# EasyEDA Pro project Wheelbase Breakout Board.epro

# Schematic Schematic1
Board Name: Board1; Create Date: 2024-10-20
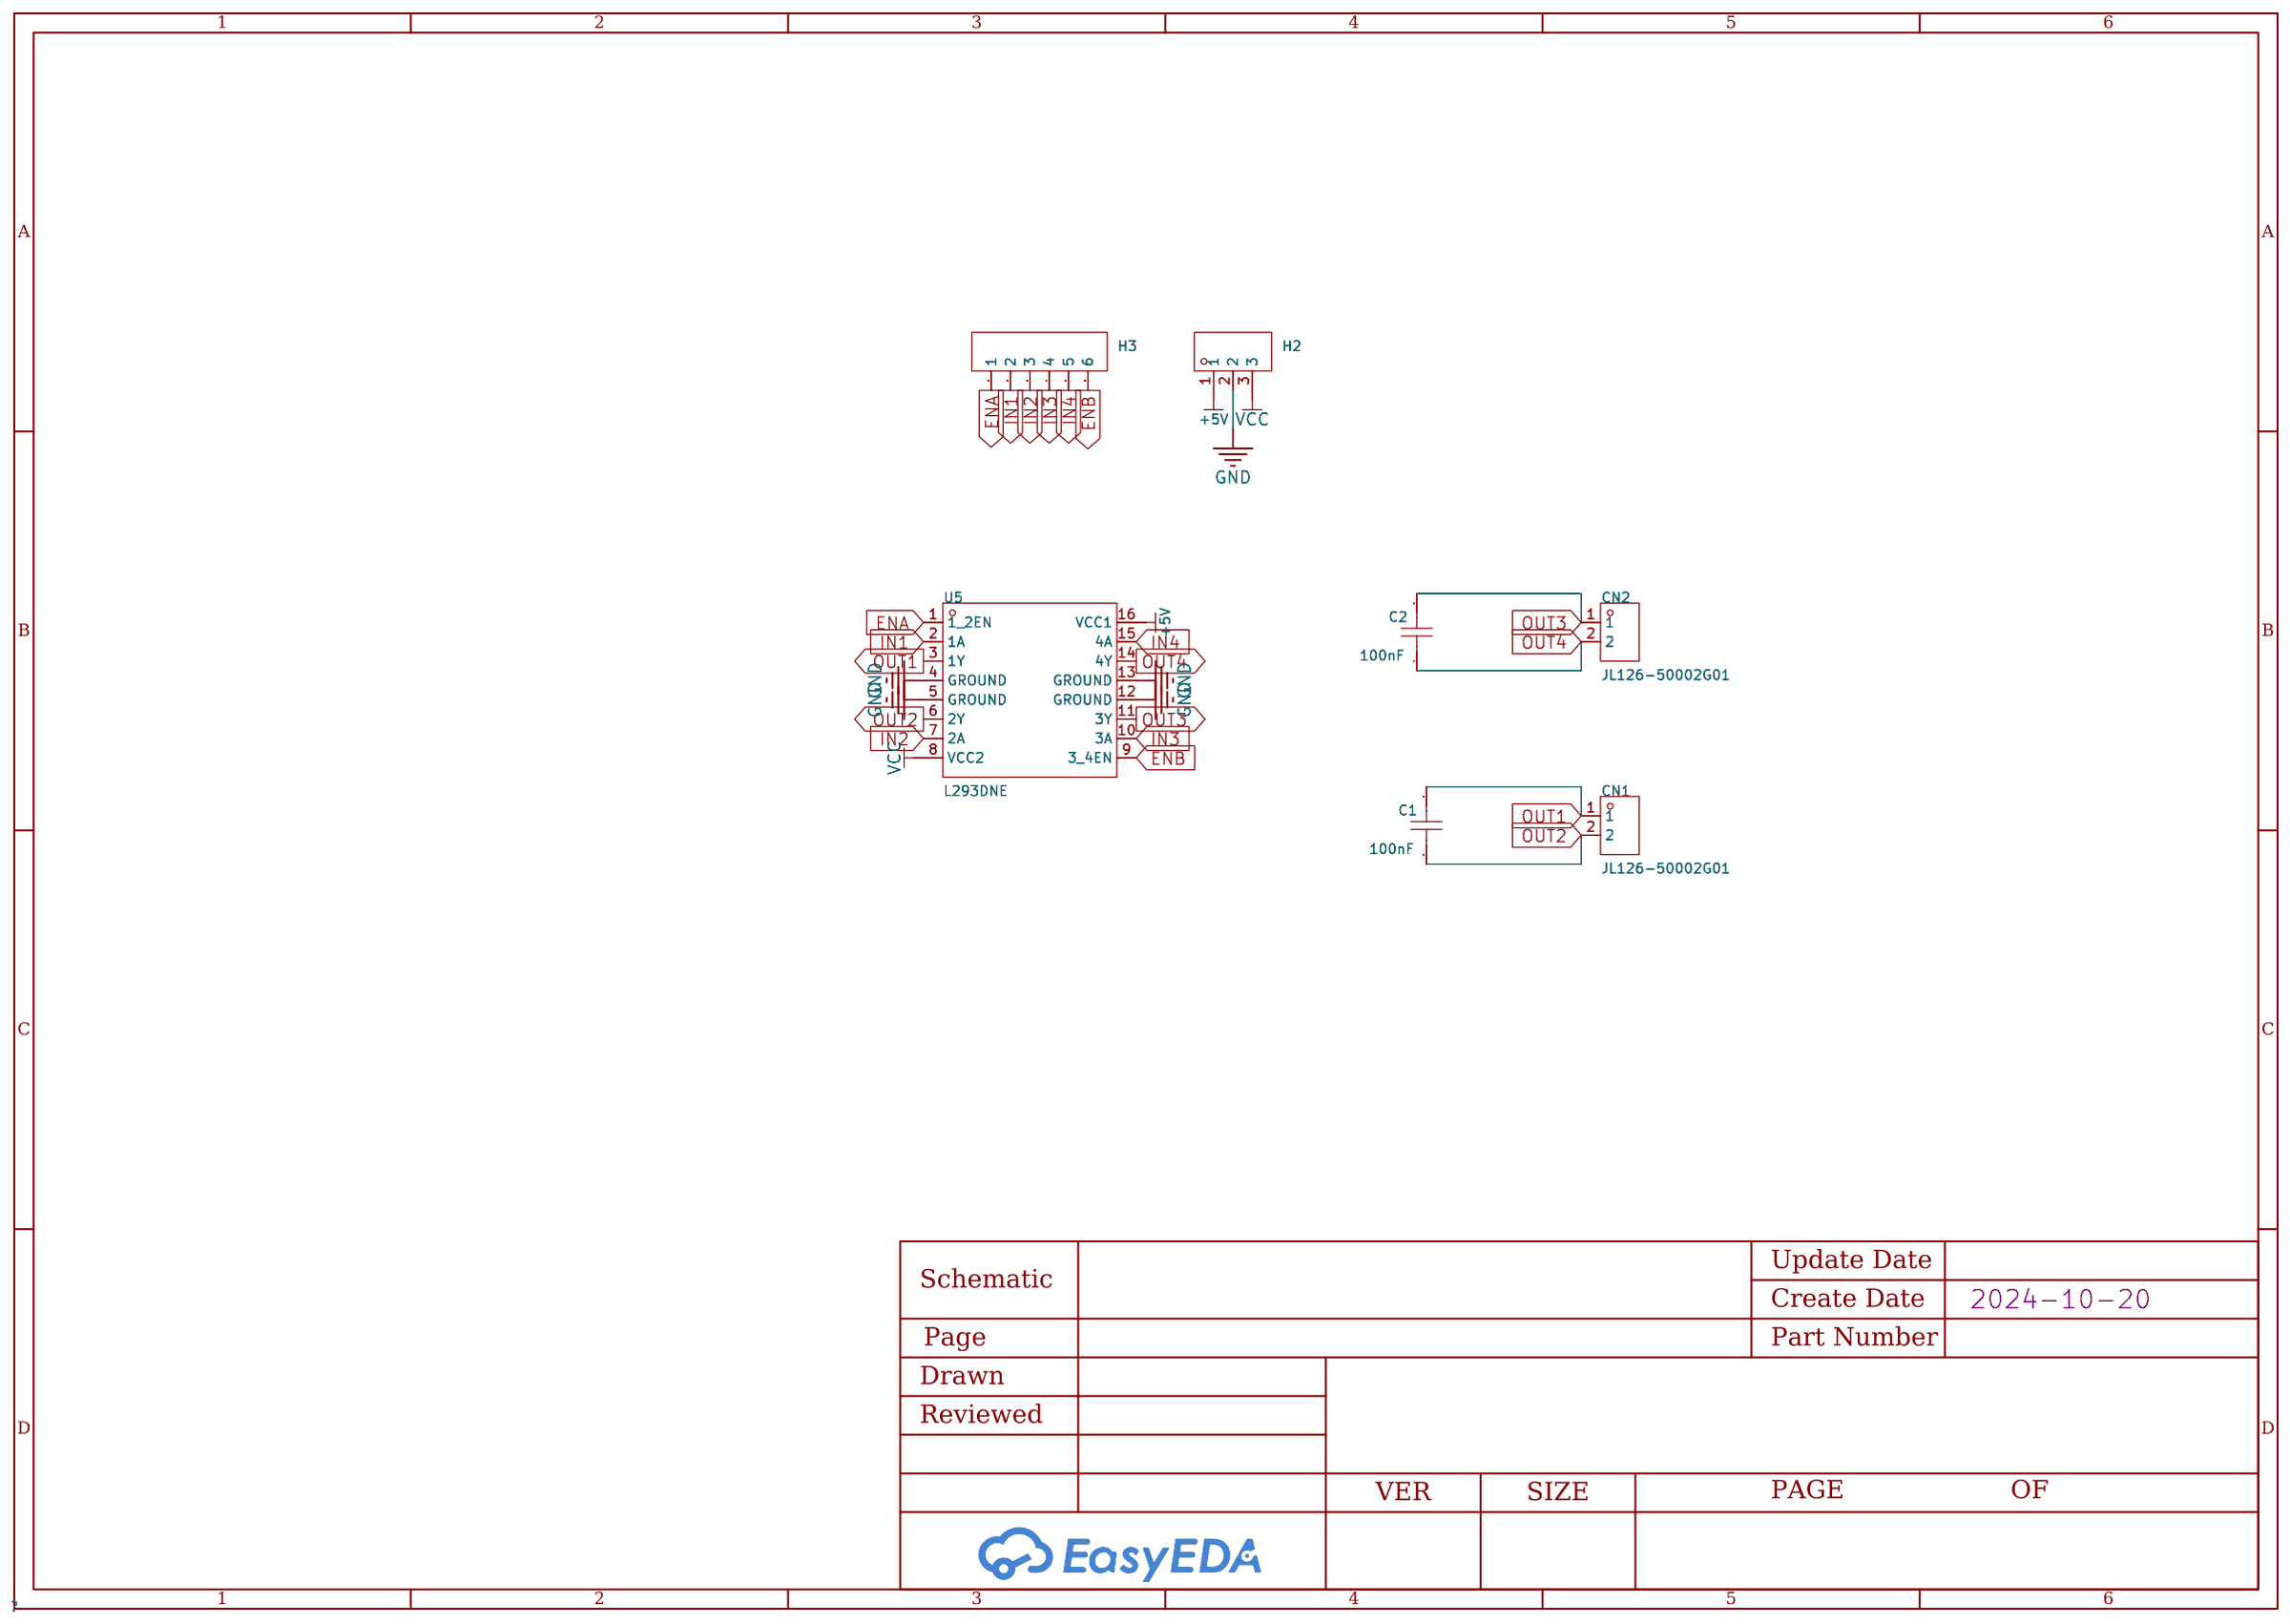
[diagram p0: schematic sheet]

## Parts
C1  100nF  [CAP-TH_L6.5-W2.5-P7.50-D0.5]
C2  100nF  [CAP-TH_L6.5-W2.5-P7.50-D0.5]
CN1  JL126-50002G01  [CONN-TH_2P-P5.00_JL126-50002G01]
CN2  JL126-50002G01  [CONN-TH_2P-P5.00_JL126-50002G01]
H2  -  [HDR-TH_3P-P2.54-V-M]
H3  -  [HDR-TH_6P-P2.54-V-M-1]
U5  L293DNE  [DIP-16_L20.0-W6.4-P2.54-LS7.6-BL]

## Library data of the parts
C1 C2 = CD1H104K0DPHR1D000: Capacitance: Tolerance:±10% Tolerance:±10% Voltage Rated: Temperature Coefficient:; LCSC Part Name: 100nF ±10% 50V; Supplier Part: C19712519; Manufacturer: Dersonic(德尔创); Supplier Footprint: 插件,D2.5xL4.3mm; Datasheet: https://atta.szlcsc.com/upload/public/pdf/source/20231222/2AD44742B80979154829E3F52B22BAB3.pdf; Supplier: LCSC; Tolerance: ±10%
CN1 CN2 = JL126-50002G01: Structure:1x2P Pitch:5mm Color:Green Mounting Style:Direct Insert Current Rating (Max):10A Voltage Rating (Max):300V Number of Pins:2P Number of Rows:1 Wire Gauge - AWG:14~20 Wire Gauge - AWG:14~20 Number of PINs Per Row:2 Contact Material:Brass Contact P; LCSC Part Name: 1x2P 5mm 直插 排数:1 每排P数:2; Supplier Part: C394556; Manufacturer: JILN(锦凌); Supplier Footprint: 插件,P=5mm; JLCPCB Part Class: Extended Part; Datasheet: https://atta.szlcsc.com/upload/public/pdf/source/20190621/C395206_C3462300E5303BFD0B2B7ECE88A976D0.pdf; Supplier: LCSC; Structure: 1x2P; Pitch: 5mm; Color: Green; Mounting Style: Direct Insert; Current Rating (Max): 10A; Voltage Rating (Max): 300V; Number of Pins: 2P; Number of Rows: 1; Wire Gauge - AWG: 14~20; Number of PINs Per Row: 2; Contact Material: Brass; Contact Plating: Tin; Operating Temperature Range: -40℃~+105℃; Screw Specification: M2.5
H2 = HDR-M_2.54_1x3P: Supplier Footprint: Through
H3 = HDR-M_2.54_1x6P: Supplier Footprint: Through
U5 = L293DNE: Supply Voltage:4.5V~36V Supply Voltage:4.5V~36V Operating Temperature:0℃~+70℃@(Ta) Operating Temperature:0℃~+70℃@(Ta); Supplier Part: C701118; Manufacturer: TI(德州仪器); Supplier Footprint: DIP-16; JLCPCB Part Class: Extended Part; Datasheet: https://www.ti.com/cn/lit/gpn/l293d; Supplier: LCSC; Supply Voltage: 4.5V~36V; Operating Temperature: 0℃~+70℃@(Ta)

## Nets
+5V: H2.1 U5.16(VCC1)
GND: H2.2 U5.4(GROUND) U5.5(GROUND) U5.12(GROUND) U5.13(GROUND)
VCC: H2.3 U5.8(VCC2)
ENA: H3.1 U5.1(1_2EN)
ENB: H3.6 U5.9(3_4EN)
IN1: H3.2 U5.2(1A)
IN2: H3.3 U5.7(2A)
IN3: H3.4 U5.10(3A)
IN4: H3.5 U5.15(4A)
OUT1: C1.1 CN1.1 U5.3(1Y)
OUT2: C1.2 CN1.2 U5.6(2Y)
OUT3: C2.2 CN2.1 U5.11(3Y)
OUT4: C2.1 CN2.2 U5.14(4Y)

# Board PCB1
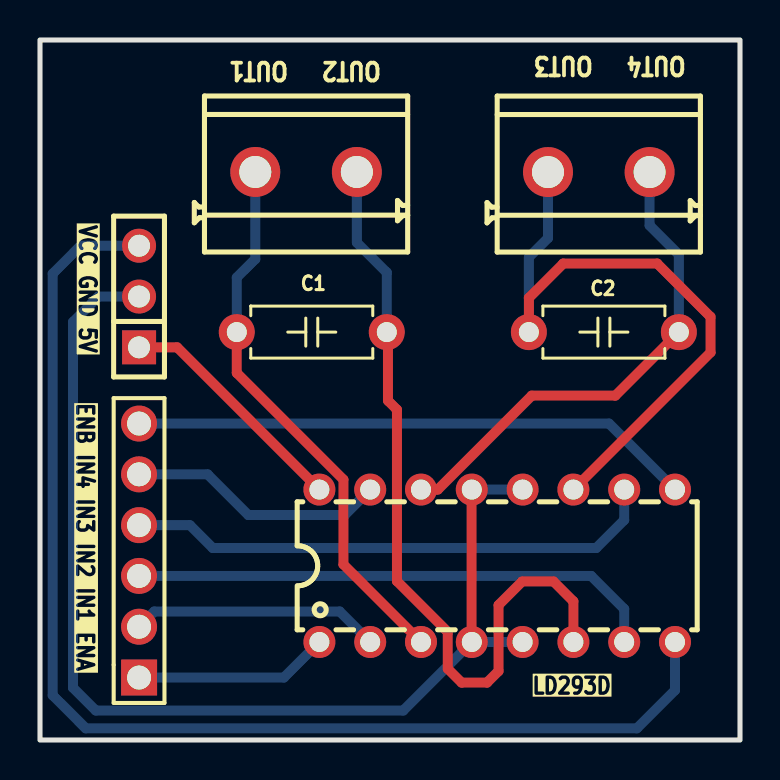
[diagram p1: board, top side]
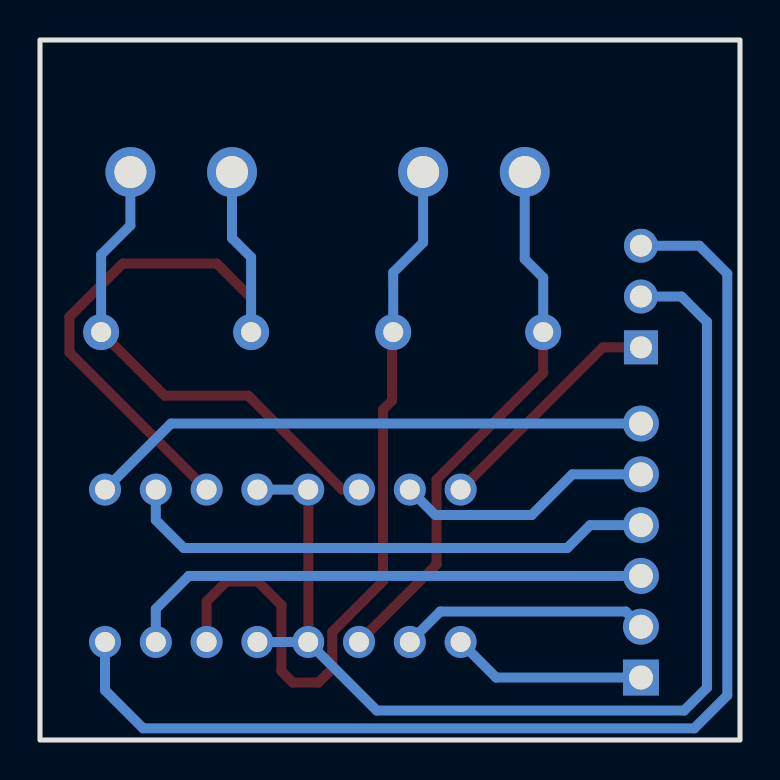
[diagram p2: board, bottom side, seen from below]

Outline 35 x 35 mm; copper layers: Top Layer, Bottom Layer. Coordinates in mm from the lower left corner of the outline.
Outline path: rectangle 0,35 35,0
Stack: Top Layer 0.035mm / Dielectric1 1.51mm FR4 er 4.5 / Bottom Layer 0.035mm

## Design rules (mm)
template: JLCPCB Capability(Two Layers Board)
spacing copperThickness1oz (default): track to track 0.102, other pairs 0.152 to 0.3
spacing copperThickness2oz: track to track 0.203, other pairs 0.152 to 0.3
track width copperThickness1oz (default): min 0.127, default 0.254, max 2.54
track width copperThickness2oz: min 0.203, default 0.254, max 2.54
differential pair differentialPair (default): width min 0.127, default 0.254, max 2.54; gap min 0.152, default 0.152
via viaSize (default): diameter min 0.5, default 0.61, max 10; hole min 0.3, default 0.305, max 6.3

## Placement (name value [footprint] x y rotation side)
C1  100nF  [CAP-TH_L6.5-W2.5-P7.50-D0.5]  13.59 20.39 0 top
C2  100nF  [CAP-TH_L6.5-W2.5-P7.50-D0.5]  28.19 20.39 180 top
CN1  JL126-50002G01  [CONN-TH_2P-P5.00_JL126-50002G01]  13.3 28.4 0 top
CN2  JL126-50002G01  [CONN-TH_2P-P5.00_JL126-50002G01]  27.94 28.4 0 top
H2  -  [HDR-TH_3P-P2.54-V-M]  4.95 22.17 90 top
H3  -  [HDR-TH_6P-P2.54-V-M-1]  4.95 9.47 90 top
U5  L293DNE  [DIP-16_L20.0-W6.4-P2.54-LS7.6-BL]  22.86 8.71 0 top

## Footprints (pads in the part's own frame, mm; a bottom-side part is the same pattern mirrored in y, then rotated)
CAP-TH_L6.5-W2.5-P7.50-D0.5
  round 1.8 hole 1: 1(-3.75,0) 2(3.75,0)
CONN-TH_2P-P5.00_JL126-50002G01
  round 2.5 hole 1.6: 1(-2.54,0) 2(2.54,0)
DIP-16_L20.0-W6.4-P2.54-LS7.6-BL
  round 1.6 hole 1: 1(-8.89,-3.81) 2(-6.35,-3.81) 3(-3.81,-3.81) 4(-1.27,-3.81) 5(1.27,-3.81) 6(3.81,-3.81) 7(6.35,-3.81) 8(8.89,-3.81) 9(8.89,3.81) 10(6.35,3.81) 11(3.81,3.81) 12(1.27,3.81) 13(-1.27,3.81) 14(-3.81,3.81) 15(-6.35,3.81) 16(-8.89,3.81)
HDR-TH_3P-P2.54-V-M
  rect 1.7x1.7 hole 1.1: 1(-2.54,0)
  round 1.7 hole 1.1: 2(0,0) 3(2.54,0)
HDR-TH_6P-P2.54-V-M-1
  rect 1.8x1.8 hole 1.2: 1(-6.35,0)
  round 1.8 hole 1.2: 2(-3.81,0) 3(-1.27,0) 4(1.27,0) 5(3.81,0) 6(6.35,0)

## Nets
As in the schematic.

## Routing (per net, layer and track width the routed paths; a pad name or vN(x,y) marks a point on that pad's centre or on a via; arc(x,y) is an arc through that point)
+5V: length 12
  Top Layer w0.5: U5.16 6.86,19.63 H2.1
GND: length 56.7
  Top Layer w0.5: U5.4 21.58,4.91 21.58,12.51 U5.13
  Bottom Layer w0.5: U5.5 U5.4 18.16,1.47 2.79,1.47 1.65,2.61 1.65,20.9 2.92,22.17 H2.2 ; U5.12 U5.13
VCC: length 61
  Bottom Layer w0.5: H2.3 2.03,24.71 0.63,23.32 0.63,2.23 2.29,0.58 29.84,0.58 31.75,2.49 U5.8
ENA: length 9.8
  Bottom Layer w0.5: U5.1 12.19,3.12 H3.1
ENB: length 28.2
  Bottom Layer w0.5: U5.9 28.45,15.82 H3.6
IN1: length 12.5
  Bottom Layer w0.5: U5.2 14.99,6.42 5.71,6.42 H3.2
IN2: length 26.6
  Bottom Layer w0.5: U5.7 29.21,6.55 27.56,8.2 H3.3
IN3: length 26.8
  Bottom Layer w0.5: U5.10 29.21,11 27.81,9.6 8.64,9.6 7.49,10.74 H3.4
IN4: length 12.9
  Bottom Layer w0.5: H3.5 8.38,13.28 10.41,11.25 15.24,11.25 U5.15
OUT1: length 27.7
  Top Layer w0.5: U5.3 15.17,8.78 15.17,13.02 9.84,18.35 C1.1
  Bottom Layer w0.5: C1.1 9.84,23.12 10.76,24.05 CN1.1
OUT2: length 39.8
  Top Layer w0.5: C1.2 17.4,20.33 17.4,16.97 17.85,16.52 17.85,7.94 20.39,5.4 20.39,3.56 21.08,2.87 22.35,2.87 22.93,3.44 22.93,6.75 24.11,7.93 25.68,7.93 26.67,6.93 U5.6
  Bottom Layer w0.5: C1.2 17.34,23.38 15.84,24.87 CN1.2
OUT3: length 32.5
  Top Layer w0.5: U5.11 33.53,19.38 33.53,21.16 30.86,23.82 26.16,23.82 24.44,22.11 C2.2
  Bottom Layer w0.5: C2.2 24.44,24.14 25.4,25.09 CN2.1
OUT4: length 24.8
  Top Layer w0.5: U5.14 19.89,12.52 24.59,17.22 28.77,17.22 C2.1
  Bottom Layer w0.5: C2.1 31.94,24.27 30.48,25.73 CN2.2

## Text on the board
Top Silkscreen Layer: LD293D | ENB IN4 IN3 IN2 IN1 ENA | VCC GND 5V | OUT2   OUT1 | OUT4   OUT3
